# Altium schematic sheet Power.SchDoc
size A
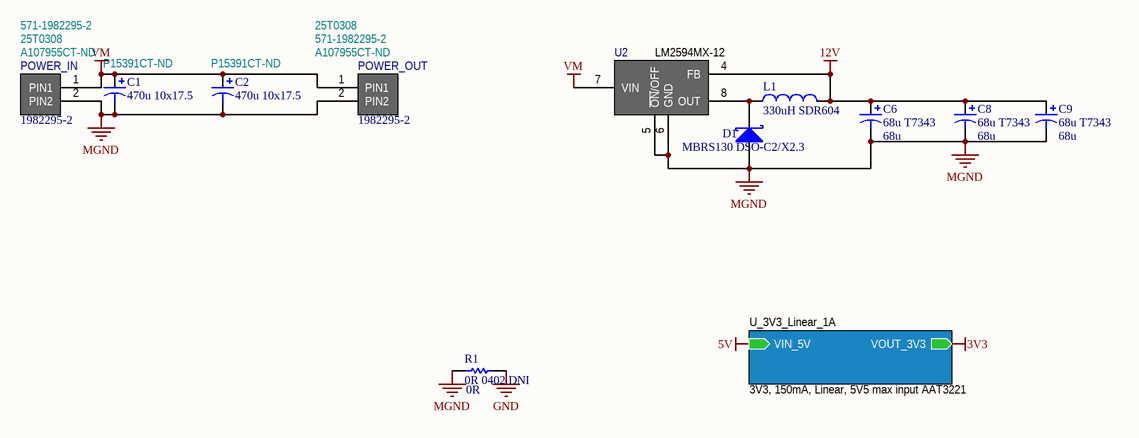
[diagram p0: Power.SchDoc]

## Parts
C1  470u 10x17.5  Supplier Part Number 1: P15391CT-ND  [CAPPR5-10x17.5]
C2  470u 10x17.5  Supplier Part Number 1: P15391CT-ND  [CAPPR5-10x17.5]
C6  68u T7343  value 68u  [TC7343-2917]
C8  68u T7343  value 68u  [TC7343-2917]
C9  68u T7343  value 68u  [TC7343-2917]
D1  MBRS130 DSO-C2/X2.3  [DSO-C2/X2.3]
L1  330uH SDR604  [SDR604]
POWER_IN  1982295-2  Supplier Part Number 1: A107955CT-ND  Supplier Part Number 2: 25T0308  Supplier Part Number 3: 571-1982295-2  [1982295-2]
POWER_OUT  1982295-2  Supplier Part Number 1: A107955CT-ND  Supplier Part Number 2: 571-1982295-2  Supplier Part Number 3: 25T0308  [1982295-2]
R1  0R 0402 DNI  value 0R  [RESC2012N]
U2  LM2594MX-12  [SOIC127P600-8CN]

## Sub-sheets
U_3V3_Linear_1A = 3V3, 150mA, Linear, 5V5 max input AAT3221: VIN_5V (in), VOUT_3V3 (out)

## Nets
3V3: sheet U_3V3_Linear_1A/VOUT_3V3
5V: sheet U_3V3_Linear_1A/VIN_5V
12V: C6.1 C8.1 C9.1 L1.2 U2.4(FB)
GND: R1.1
MGND: C1.2 C2.2 C6.2 C8.2 C9.2 D1.1(A) POWER_IN.2(PIN2) POWER_OUT.2(PIN2) R1.2 U2.5(~{ON}/OFF) U2.6(GND)
VM: C1.1 C2.1 POWER_IN.1(PIN1) POWER_OUT.1(PIN1) U2.7(VIN)
NetD1_2: D1.2(K) L1.1 U2.8(OUT)

## Library data of the parts
C1 C2 C6 C8 C9 = Cap Pol1: Polarized Capacitor (Radial); Published: 8-Jun-2000; LatestRevisionDate: 17-Jul-2002; LatestRevisionNote: Re-released for DXP Platform.; PackageReference: RB7.6-15; Publisher: Altium Limited; PackageDescription: Polarized Capacitor (Radial); 2 Leads; Supplier 1: Digi-Key
  C6 C8 C9: Supplier Part Number 1: 495-1561-1-ND
D1 = D Schottky: Schottky Diode; Published: 8-Jun-2000; LatestRevisionDate: 17-Jul-2002; LatestRevisionNote: Re-released for DXP Platform.; PackageReference: SMB; Publisher: Altium Limited; PackageDescription: DO-214-AA/SMB; 2 C-Bend Leads; Body 5.3 x 3.6 mm, inc. leads (LxW); Code_JEDEC: DO-214-AA; Supplier 1: Digi-Key; Supplier Part Number 1: MBRS130FSCT-ND
L1 = Inductor: Code_IEC: 1005; Value: 330u; Published: 8-Jun-2000; LatestRevisionDate: 29-May-2009; LatestRevisionNote: IPC-7351 Footprint Added.; PackageReference: 0402-A; Publisher: Altium Limited; PackageDescription: Chip Inductor; Code_JEITA: 0402; Supplier 1: Digi-Key; Supplier Part Number 1: SDR0604-331KLCT-ND
R1 = Res Semi: Semiconductor Resistor; Published: 8-Jun-2000; LatestRevisionDate: 17-Jul-2002; LatestRevisionNote: Re-released for DXP Platform.; PackageReference: AXIAL-0.5; Publisher: Altium Limited; PackageDescription: Axial Device, Thru-Hole; 2 Leads; 0.5 in Pin Spacing
POWER_IN POWER_OUT = 1982295-2: Supplier 1: Digi-Key
  POWER_IN: Supplier 2: Newark; Supplier 3: Mouser
  POWER_OUT: Supplier 2: Mouser; Supplier 3: Newark
U2 = LM2594MX-12: Supplier 1: Digi-Key; Supplier Part Number 1: LM2594M-12/NOPB-ND